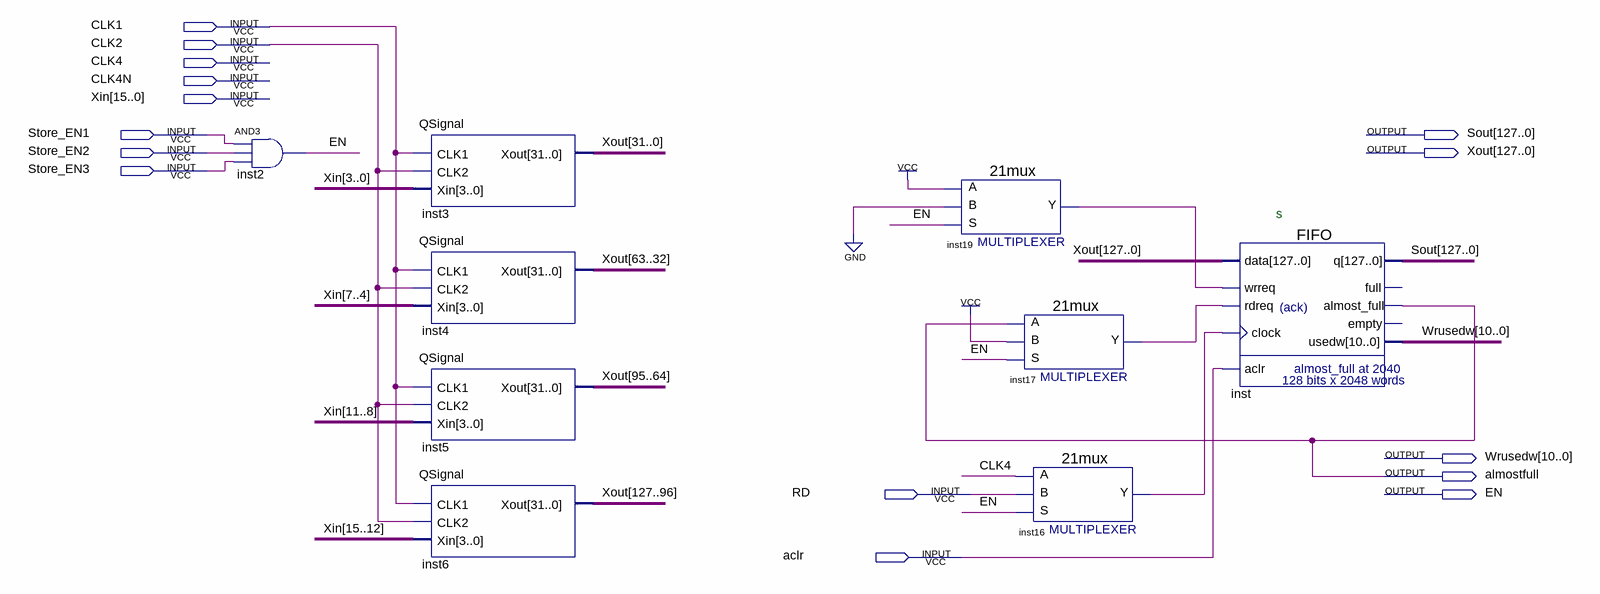
[diagram p0: schematic sheet]
// Quartus schematic AllStore.bdf as structural Verilog: 9 symbols, 15 pins
module AllStore (
  input  CLK1,
  input  CLK2,
  input  CLK4,
  input  CLK4N,
  input  [15:0] Xin,
  input  Store_EN1,
  input  Store_EN2,
  input  Store_EN3,
  input  RD,
  input  aclr,
  output [127:0] Sout,
  output [127:0] Xout,
  output [10:0] Wrusedw,
  output almostfull,
  output EN
);

  wire inst16_y, inst17_y, inst19_y;

  and inst2 (EN, Store_EN1, Store_EN2, Store_EN3);
  QSignal inst3 (.CLK1(CLK1), .CLK2(CLK2), .Xin(Xin[3:0]), .Xout(Xout[31:0]));
  QSignal inst4 (.CLK1(CLK1), .CLK2(CLK2), .Xin(Xin[7:4]), .Xout(Xout[63:32]));
  QSignal inst5 (.CLK1(CLK1), .CLK2(CLK2), .Xin(Xin[11:8]), .Xout(Xout[95:64]));
  QSignal inst6 (.CLK1(CLK1), .CLK2(CLK2), .Xin(Xin[15:12]), .Xout(Xout[127:96]));
  \21mux  inst19 (.S(EN), .B(1'b0), .A(1'b1), .Y(inst19_y));
  \21mux  inst17 (.S(EN), .B(1'b1), .A(almostfull), .Y(inst17_y));
  \21mux  inst16 (.S(EN), .B(RD), .A(CLK4), .Y(inst16_y));
  FIFO inst (
    .data(Xout), .wrreq(inst19_y), .rdreq(inst17_y), .clock(inst16_y), .aclr(aclr), .q(Sout),
    .almost_full(almostfull), .usedw(Wrusedw));  // open: full, empty

  // Notes on the sheet:
  //   s
endmodule
